# Altium schematic sheet COVER PAGE.SchDoc: COVER PAGE
size A4; SheetNumber: 1; SheetTotal: 5
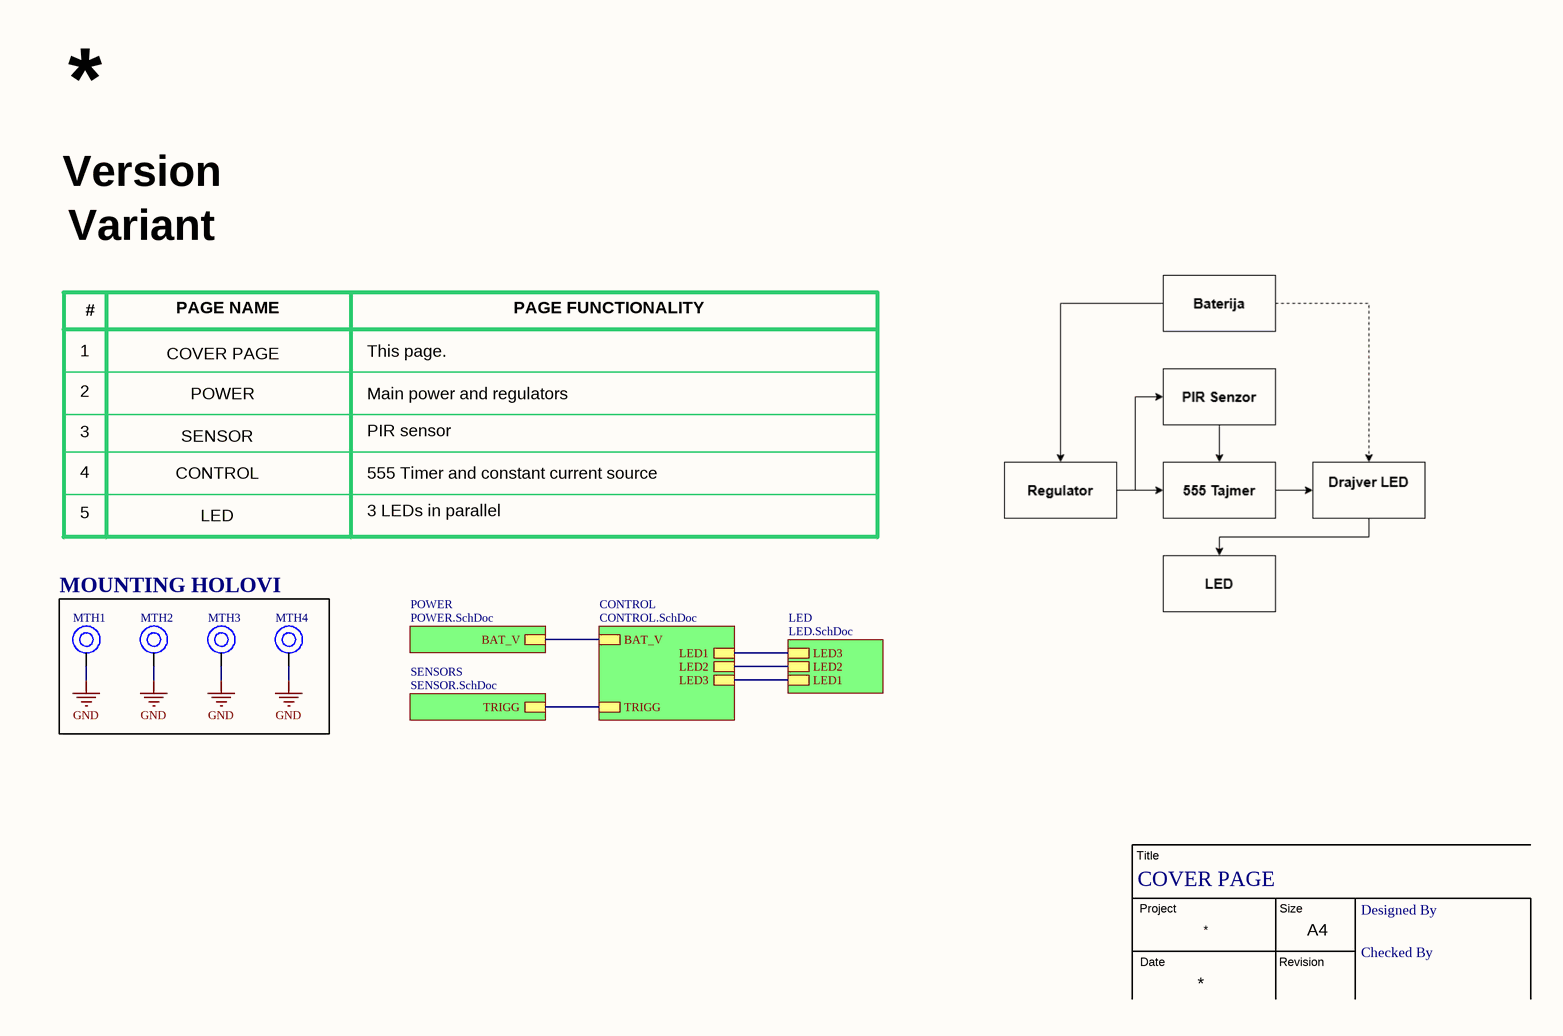
[diagram p0: COVER PAGE.SchDoc]

## Parts
MTH1  MTH  [MOUNTING_HOLE_M3]  (value not drawn)  (no BOM)
MTH2  MTH  [MOUNTING_HOLE_M3]  (value not drawn)  (no BOM)
MTH3  MTH  [MOUNTING_HOLE_M3]  (value not drawn)  (no BOM)
MTH4  MTH  [MOUNTING_HOLE_M3]  (value not drawn)  (no BOM)

## Blocks framed on the sheet
MOUNTING HOLOVI: MTH1-MTH4

## Sub-sheets
CONTROL = CONTROL.SchDoc: BAT_V, TRIGG, LED1, LED2, LED3
LED = LED.SchDoc: LED1, LED2, LED3
POWER = POWER.SchDoc: BAT_V
SENSORS = SENSOR.SchDoc: TRIGG

## Nets
GND: MTH1.1 MTH2.1 MTH3.1 MTH4.1
(unnamed): sheet CONTROL/BAT_V, sheet POWER/BAT_V
(unnamed): sheet CONTROL/TRIGG, sheet SENSORS/TRIGG
(unnamed): sheet CONTROL/LED1, sheet LED/LED3
(unnamed): sheet CONTROL/LED2, sheet LED/LED2
(unnamed): sheet CONTROL/LED3, sheet LED/LED1

## Notes on the sheet
- Variant
- Version
- #
- PAGE NAME
- PAGE FUNCTIONALITY
- 1
- COVER PAGE
- This page.
- 2
- 3
- SENSOR
- POWER
- Main power and regulators
- PIR sensor
- 4
- 5
- CONTROL
- LED
- 555 Timer and constant current source
- 3 LEDs in parallel
- Title
- Project
- Size
- Designed By
- Date
- Revision
- A4
- Checked By

## Library data of the parts
MTH1-MTH4 = MTH: Mounting hole; MPN: *